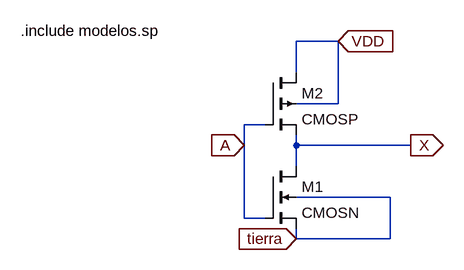
[diagram p0: schematic Inversor3mA.asc]
Inversor3mA.asc, the LTspice schematic file:
Version 4
SHEET 1 1388 680
WIRE 368 16 304 16
WIRE 304 64 304 16
WIRE 368 112 368 16
WIRE 368 112 304 112
WIRE 256 144 224 144
WIRE 224 176 224 144
WIRE 304 176 304 160
WIRE 480 176 304 176
WIRE 304 208 304 176
WIRE 448 256 304 256
WIRE 224 288 224 176
WIRE 256 288 224 288
WIRE 304 320 304 304
WIRE 448 320 448 256
WIRE 448 320 304 320
FLAG 224 176 A
IOPIN 224 176 In
FLAG 480 176 X
IOPIN 480 176 Out
FLAG 368 16 VDD
IOPIN 368 16 In
FLAG 304 320 tierra
IOPIN 304 320 In
SYMBOL nmos4 256 208 R0
SYMATTR InstName M1
SYMATTR Value CMOSN
SYMATTR Value2 l=0.6u w=10.8u
SYMBOL pmos4 256 64 R0
SYMATTR InstName M2
SYMATTR Value CMOSP
SYMATTR Value2 l=.6u w=39.6u
TEXT -120 0 Left 2 !.include modelos.sp

The netlist it stands for:
* Inversor3mA.asc
M1 X A tierra tierra CMOSN l=0.6u w=10.8u
M2 VDD A X VDD CMOSP l=.6u w=39.6u
.model NMOS NMOS
.model PMOS PMOS
.lib standard.mos
.include modelos.sp
.backanno
.end